# Altium schematic sheet [03] - SUMOBOT.SchDoc
size A4
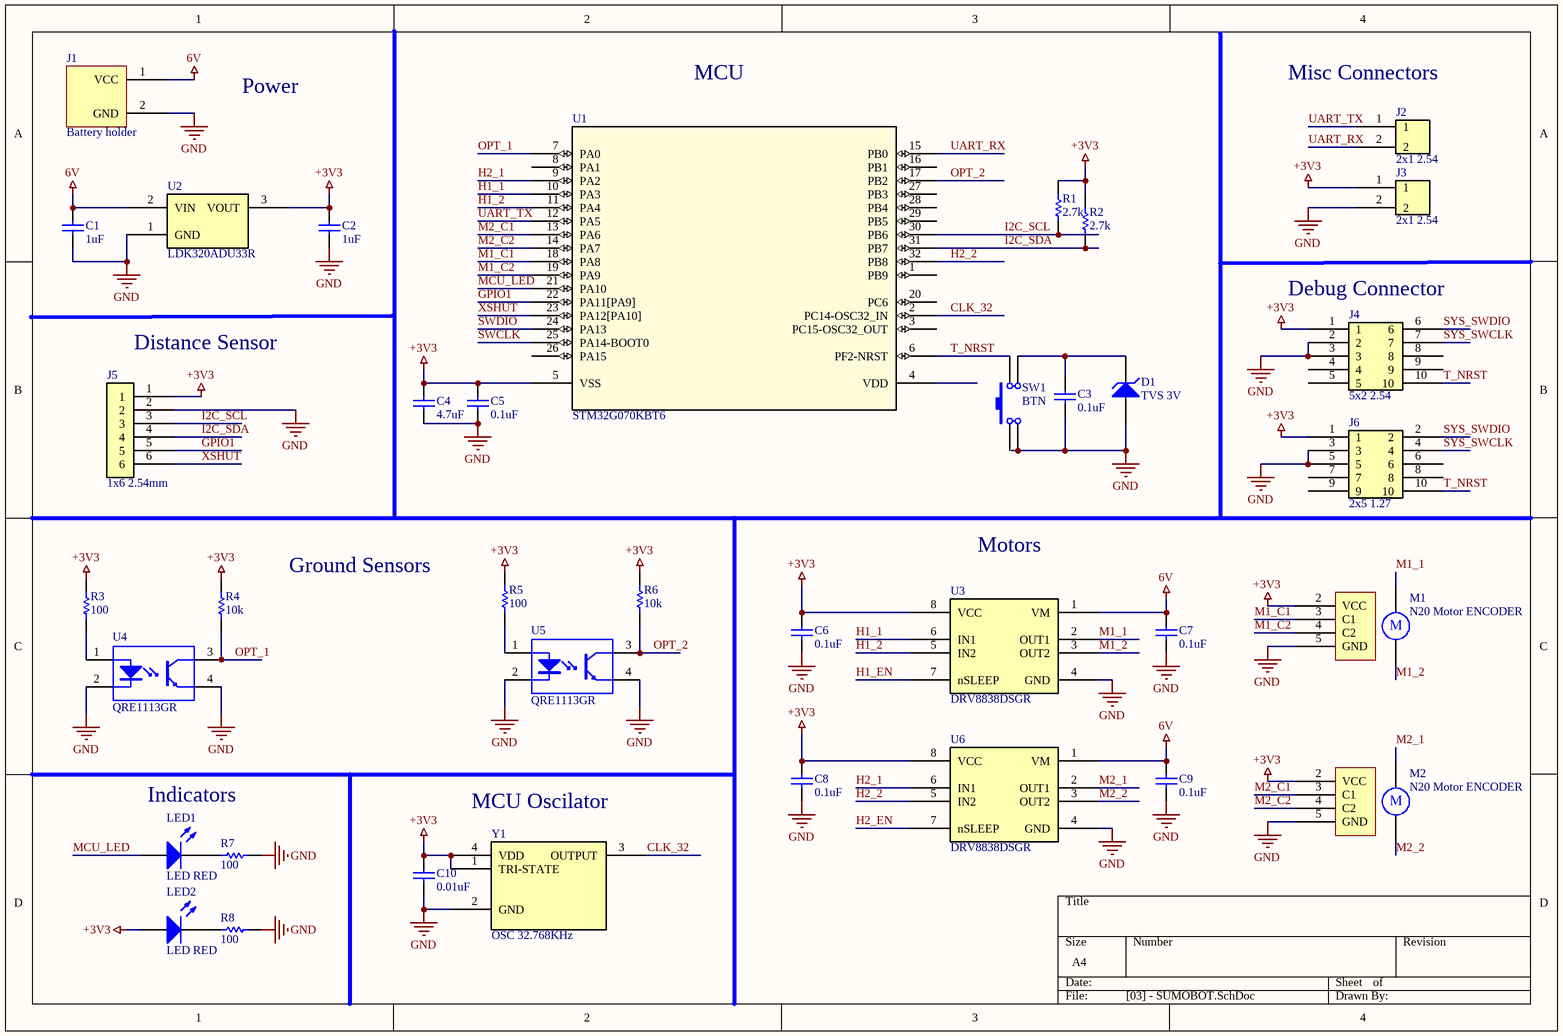
[diagram p0: [03] - SUMOBOT.SchDoc]

## Parts
C1  1uF  [CAPC2012X14N]
C2  1uF  [CAPC2012X14N]
C3  0.1uF  [CAPC2012X14N]
C4  4.7uF  [CAPC2012X14N]
C5  0.1uF  [CAPC2012X14N]
C6  0.1uF  [CAPC2012X14N]
C7  0.1uF  [CAPC2012X14N]
C8  0.1uF  [CAPC2012X14N]
C9  0.1uF  [CAPC2012X14N]
C10  0.01uF  [CAPC2012X14N]
D1  TVS 3V  [ST0201]
J1  Battery holder  [Battery Holder]
J2  2x1 2.54  [2 2.54]
J3  2x1 2.54  [2 2.54]
J4  5x2 2.54  [5x2 2.54]
J5  1x6 2.54mm  [PIN 6x1 2.54mm]
J6  2x5 1.27  [5x2 1.27]
LED1  LED RED  [LED 0805]
LED2  LED RED  [LED 0805]
M1  N20 Motor ENCODER  [N20 MOTOR - ENCODER]
M2  N20 Motor ENCODER  [N20 MOTOR - ENCODER]
R1  2.7k  [RESC2012X07N]
R2  2.7k  [RESC2012X07N]
R3  100  [RESC2012X07N]
R4  10k  [RESC2012X07N]
R5  100  [RESC2012X07N]
R6  10k  [RESC2012X07N]
R7  100  [RESC2012X07N]
R8  100  [RESC2012X07N]
SW1  BTN  [Button]
U1  STM32G070KBT6  [LQFP-32]
U2  LDK320ADU33R  [SOT89-150P349X160-3N]
U3  DRV8838DSGR  [SON50P200X80_HS-9N2]
U4  QRE1113GR  [FAIR-QRE1113GR_V]
U5  QRE1113GR  [FAIR-QRE1113GR_V]
U6  DRV8838DSGR  [SON50P200X80_HS-9N2]
Y1  OSC 32.768KHz  [ECS-327MVATX]

## Nets
6V: C1.2 C7.2 C9.2 J1.1(VCC) U2.2(VIN) U3.1(VM) U6.1(VM)
+3V3: C2.2 C4.2 C5.2 C6.2 C8.2 C10.2 J3.1 J4.1 J5.1 J6.1 LED2.1(A) M1.2(VCC) M2.2(VCC) R1.2 R2.2 R3.2 R4.2 R5.2 R6.2 U1.5(VSS) U2.3(VOUT) U3.8(VCC) U6.8(VCC) Y1.1(TRI-STATE) Y1.4(VDD)
GND: C1.1 C2.1 C3.1 C4.1 C5.1 C6.1 C7.1 C8.1 C9.1 C10.1 D1.2(A) J1.2(GND) J3.2 J4.2 J4.3 J5.2 J6.3 J6.5 M1.5(GND) M2.5(GND) R7.1 R8.1 SW1.2 U2.1(GND) U3.4(GND) U4.2(CATHODE) U4.4(EMITTER) U5.2(CATHODE) U5.4(EMITTER) U6.4(GND) Y1.2(GND)
CLK_32: U1.2(PC14-OSC32_IN) Y1.3(OUTPUT)
GPIO1: J5.5 U1.22(PA11[PA9])
H1_1: U1.10(PA3) U3.6(IN1)
H1_2: U1.11(PA4) U3.5(IN2)
H1_EN: U3.7(nSLEEP)
H2_1: U1.9(PA2) U6.6(IN1)
H2_2: U1.32(PB8) U6.5(IN2)
H2_EN: U6.7(nSLEEP)
I2C_SCL: J5.3 R1.1 U1.30(PB6)
I2C_SDA: J5.4 R2.1 U1.31(PB7)
M1_1: M1.1 U3.2(OUT1)
M1_2: M1.6 U3.3(OUT2)
M1_C1: M1.3(C1) U1.18(PA8)
M1_C2: M1.4(C2) U1.19(PA9)
M2_1: M2.1 U6.2(OUT1)
M2_2: M2.6 U6.3(OUT2)
M2_C1: M2.3(C1) U1.13(PA6)
M2_C2: M2.4(C2) U1.14(PA7)
MCU_LED: LED1.1(A) U1.21(PA10)
OPT_1: R4.1 U1.7(PA0) U4.3(COLLECTOR)
OPT_2: R6.1 U1.17(PB2) U5.3(COLLECTOR)
SWCLK: U1.25(PA14-BOOT0)
SWDIO: U1.24(PA13)
SYS_SWCLK: J4.7 J6.4
SYS_SWDIO: J4.6 J6.2
T_NRST: J4.10 J6.10 SW1.3 U1.6(PF2-NRST)
UART_RX: J2.2 U1.15(PB0)
UART_TX: J2.1 U1.12(PA5)
XSHUT: J5.6 U1.23(PA12[PA10])
NetC3_2: C3.2 D1.1(K) SW1.4
NetLED1_2: LED1.2(K) R7.2
NetLED2_2: LED2.2(K) R8.2
NetR3_1: R3.1 U4.1(ANODE)
NetR5_1: R5.1 U5.1(ANODE)

Not connected (* = marked no-connect by the designer): J4 4 5 8 9; J6 6 7 8 9; SW1 1; U1 1(PB9) 3(PC15-OSC32_OUT) 4(VDD) 8(PA1) 16(PB1) 20(PC6) 26(PA15) 27(PB3) 28(PB4) 29(PB5)

## Notes on the sheet
- Power
- MCU
- (near J2) Misc Connectors
- (near J4) Debug Connector
- (near J5) Distance Sensor
- Ground Sensors
- Motors
- Indicators
- (near Y1) MCU Oscilator
- (in symbol N20 Motor ENCODER) M

## Library data of the parts
C1 C2 = CL21B105KOFNNNG: Samsung Electro-Mechanics 1F Multilayer Ceramic Capacitor (MLCC) 16 V 10% X7R dielectric CL max op. temp. +125C; Voltage Rating: 16V; Supplier 1: Digi-Key; Manufacturer: Samsung; Manufacturer Part Number: CL21B105KOFNNNG; RoHS: Yes; Category: Ceramic Capacitors; Stock 1: 473549; Pricing 1: 1=0.10000, 10=0.06300, 100=0.02810, 500=0.02010, 1000=0.01579 (USD); Mount: Surface Mount; Case/Package: 0805; Case Code (Imperial): 0805; Material: Ceramic; Case Code (Metric): 2012; Min Operating Temperature: -55°C; Max Operating Temperature: 125°C; Dielectric: X7R; Package Quantity: 3000; Packaging: Tape and Reel; Capacitance: 1uF; Tolerance: 10%; Voltage: 16V; Length: 2mm; Height: 1.25mm; Width: 0.049inch; Thickness: 0.053inch; Depth: 1.25mm; Lead Free: Lead Free; ComponentLink1URL: https://datasheet.ciiva.com/25733/cl21b105kofnnng-25733281.pdf?src-supplier=Digi-Key; ComponentLink1Description: https://datasheet.ciiva.com/25733/cl21b105kofnnng-25733281.pdf?src-supplier=Digi-Key; ComponentLink2URL: https://datasheet.ciiva.com/29199/455935-da-01-en-vs-kondensator-0805-29199047.pdf?src-supplier=Conrad; ComponentLink2Description: https://datasheet.ciiva.com/29199/455935-da-01-en-vs-kondensator-0805-29199047.pdf?src-supplier=Conrad; ComponentLink3URL: https://datasheet.ciiva.com/16428/cl05b104kq5nnnc-16428885.pdf?src-supplier=Future+Electronics; ComponentLink3Description: https://datasheet.ciiva.com/16428/cl05b104kq5nnnc-16428885.pdf?src-supplier=Future+Electronics; ComponentLink4URL: https://datasheet.ciiva.com/26310/mlcc-catalogdownload2013-eng-26310156.pdf?src-supplier=Distrelec; ComponentLink4Description: https://datasheet.ciiva.com/26310/mlcc-catalogdownload2013-eng-26310156.pdf?src-supplier=Distrelec; Supplier Part Number 1: 1276-6471-1-ND
C3 C5-C9 = CL21F104ZBCNNNC: CAP CER 0.1UF 50V Y5V 0805; Manufacturer: Samsung; Material: Ceramic; Capacitance: 100nF; Tolerance: 80%; Supplier 1: Digi-Key; Manufacturer Part Number: CL21F104ZBCNNNC; RoHS: Yes; Category: Ceramic Capacitors; Stock 1: 1521483; Pricing 1: 1=0.10000, 10=0.04400, 100=0.01970, 500=0.01406, 1000=0.01104 (USD); Mount: Surface Mount; Case/Package: 0805; Case Code (Imperial): 0805; Case Code (Metric): 2012; Min Operating Temperature: -30°C; Max Operating Temperature: 85°C; Packaging: Cut Tape; Voltage Rating: 50V; Package Quantity: 1; Dielectric: Y5V; Length: 0.079inch; Height: 0.85mm; Thickness: 0.037inch; Depth: 1.25mm; Width: 0.049inch; Radiation Hardening: No; ComponentLink1URL: https://datasheet.ciiva.com/25802/cl21f104zbcnnnc-25802965.pdf?src-supplier=Digi-Key; ComponentLink1Description: https://datasheet.ciiva.com/25802/cl21f104zbcnnnc-25802965.pdf?src-supplier=Digi-Key; Supplier Part Number 1: 1276-1007-1-ND
C4 = CL21B475KOFNNNE: SAMSUNG ELECTRO-MECHANICS - CL21B475KOFNNNE - SMD Multilayer Ceramic Capacitor, 4.7 µF, 16 V, 0805 [2012 Metric], ± 10%, X7R, CL Series; Voltage Rating (DC): 16V; Supplier 1: Digi-Key; Manufacturer: Samsung; Manufacturer Part Number: CL21B475KOFNNNE; RoHS: Yes; Category: Ceramic Capacitors; Stock 1: 1327670; Pricing 1: 1=0.38000, 10=0.25800, 100=0.14600, 500=0.10304, 1000=0.09016 (USD); Mount: Surface Mount; Case/Package: 0805; Case Code (Imperial): 0805; Case Code (Metric): 2012; Min Operating Temperature: -55°C; Max Operating Temperature: 125°C; Dielectric: X7R; Package Quantity: 2000; Packaging: Tape and Reel; Capacitance: 4.7uF; Tolerance: 10%; Voltage Rating: 16V; Length: 2mm; Height: 1.25mm; Width: 0.049inch; Thickness: 0.053inch; Depth: 1.25mm; Radiation Hardening: No; Lead Free: Lead Free; ComponentLink1URL: https://datasheet.ciiva.com/15216/getdatasheetpartid-357405-15216237.pdf?src-supplier=Verical; ComponentLink1Description: https://datasheet.ciiva.com/15216/getdatasheetpartid-357405-15216237.pdf?src-supplier=Verical; Supplier Part Number 1: 1276-2873-1-ND
C10 = CL21B103KBANNNC: SAMSUNG ELECTRO-MECHANICS - CL21B103KBANNNC - SMD Vícevrstvý Keramický Kondenzátor, 10000 pF, 50 V, 0805 [2012 Metrické], ± 10%, X7R, CL Series; Material: Ceramic; Capacitance: 10nF; Voltage: 50V; Supplier 1: Digi-Key; Manufacturer: Samsung; Manufacturer Part Number: CL21B103KBANNNC; RoHS: Yes; Category: Ceramic Capacitors; Stock 1: 1821737; Pricing 1: 1=0.10000, 10=0.05200, 100=0.02310, 500=0.01652, 1000=0.01298 (USD); Mount: Surface Mount; Case/Package: 0805; Case Code (Metric): 2012; Case Code (Imperial): 0805; Contact Plating: Tin; Min Operating Temperature: -55°C; Max Operating Temperature: 125°C; Tolerance: 10%; Dielectric: X7R; Voltage Rating (DC): 50V; Packaging: Tape and Reel; Voltage Rating: 50V; Length: 2mm; Height: 0.65mm; Depth: 1.25mm; Width: 0.049inch; Thickness: 0.03inch; Radiation Hardening: No; Lead Free: Lead Free; ComponentLink1URL: https://datasheet.ciiva.com/25709/cl21b103kbannnc-25709781.pdf?src-supplier=Digi-Key; ComponentLink1Description: https://datasheet.ciiva.com/25709/cl21b103kbannnc-25709781.pdf?src-supplier=Digi-Key; ComponentLink2URL: https://datasheet.ciiva.com/29199/455082-da-01-en-vs-kondensator-0805-29199459.pdf?src-supplier=Conrad; ComponentLink2Description: https://datasheet.ciiva.com/29199/455082-da-01-en-vs-kondensator-0805-29199459.pdf?src-supplier=Conrad; Supplier Part Number 1: 1276-1015-1-ND
D1 = ESDALC6V1-1U2: ESD Suppressor TVS 8KV 2-Pin SMD T/R; Manufacturer: STMicroelectronics; Direction: Unidirectional; Element Configuration: Single; Number of Unidirectional Channels: 1; Min Breakdown Voltage: 6.1V; Peak Pulse Power: 20W; Power Line Protection: No; Max Reverse Leakage Current: 100nA; Max Breakdown Voltage: 8V; Capacitance: 12pF; Clamping Voltage: 12.2V; ESD Protection: Yes; Test Current: 1mA; Peak Pulse Current: 2A; Supplier 1: Digi-Key; Manufacturer Part Number: ESDALC6V1-1U2; Stock 1: 10389; Pricing 1: 1=0.37000, 10=0.27500, 25=0.24800, 100=0.13080, 250=0.12944, 500=0.11590, 1000=0.09020, 2500=0.08253, 5000=0.07893 (USD); RoHS: Yes; Mount: Surface Mount; Case/Package: SMD/SMT; Number of Pins: 2; Case Code (Imperial): 0201; Case Code (Metric): 0603; Min Operating Temperature: -40°C; Max Operating Temperature: 125°C; Reverse Standoff Voltage: 3V; Package Quantity: 1; Packaging: Tape and Reel; Breakdown Voltage: 6.1V; Polarity: Unidirectional; Leakage Current: 100nA; Max Power Dissipation: 20W; Composition: Zener; Number of Channels: 1; Power Dissipation: 20W; Termination: SMD/SMT; Reverse Breakdown Voltage: 6.1V; Number of Elements: 1; Length: 0.6mm; Height: 0.33mm; Depth: 0.3mm; Width: 0.35mm; Radiation Hardening: No; Lead Free: Lead Free; REACH SVHC: No SVHC; ComponentLink1URL: https://datasheet.ciiva.com/1276/1684876-1276912.pdf?src-supplier=Element14; ComponentLink1Description: https://datasheet.ciiva.com/1276/1684876-1276912.pdf?src-supplier=Element14; ComponentLink2URL: https://datasheet.ciiva.com/16205/cd00212838-16205762.pdf?src-supplier=Future+Electronics; ComponentLink2Description: https://datasheet.ciiva.com/16205/cd00212838-16205762.pdf?src-supplier=Future+Electronics; ComponentLink3URL: https://datasheet.ciiva.com/4507/cd00212838-88488-4507763.pdf?src-supplier=Mouser; ComponentLink3Description: https://datasheet.ciiva.com/4507/cd00212838-88488-4507763.pdf?src-supplier=Mouser; ComponentLink4URL: https://datasheet.ciiva.com/15143/getdatasheetpartid-185245-15143908.pdf?src-supplier=Verical; ComponentLink4Description: https://datasheet.ciiva.com/15143/getdatasheetpartid-185245-15143908.pdf?src-supplier=Verical; ComponentLink5URL: https://datasheet.ciiva.com/337/cd00212838-337651.pdf?src-supplier=Digi-Key; ComponentLink5Description: https://datasheet.ciiva.com/337/cd00212838-337651.pdf?src-supplier=Digi-Key; ComponentLink6URL: https://datasheet.ciiva.com/337/cd00212838-337652.pdf?src-supplier=Digi-Key; ComponentLink6Description: https://datasheet.ciiva.com/337/cd00212838-337652.pdf?src-supplier=Digi-Key; ComponentLink7URL: https://datasheet.ciiva.com/337/cd00212838-337653.pdf?src-supplier=Digi-Key; ComponentLink7Description: https://datasheet.ciiva.com/337/cd00212838-337653.pdf?src-supplier=Digi-Key; ComponentLink8URL: https://datasheet.ciiva.com/11193/cd00212838-11193350.pdf?src-supplier=Avnet; ComponentLink8Description: https://datasheet.ciiva.com/11193/cd00212838-11193350.pdf?src-supplier=Avnet; ComponentLink9URL: https://datasheet.ciiva.com/22695/1684876-22695674.pdf?src-supplier=Element14; ComponentLink9Description: https://datasheet.ciiva.com/22695/1684876-22695674.pdf?src-supplier=Element14; ComponentLink10URL: https://datasheet.ciiva.com/41443/001184301-da-01-en-transil-sgl-un-esdalc6v1-1u2-st-0201-stm-41443159.pdf?src-supplier=Conrad; ComponentLink10Description: https://datasheet.ciiva.com/41443/001184301-da-01-en-transil-sgl-un-esdalc6v1-1u2-st-0201-stm-41443159.pdf?src-supplier=Conrad; Supplier Part Number 1: 497-8752-1-ND
J2 J3 = PREC002SAAN-RC: CONN HEADER VERT 2POS 2.54MM; Manufacturer: Sullins; Number of Positions: 2; Connector Type: Male Pin; Pitch: 0.1inch; Supplier 1: Digi-Key; Manufacturer Part Number: PREC002SAAN-RC; Stock 1: 67037; Pricing 1: 1=0.06000, 10=0.05600, 25=0.04160, 50=0.03560, 100=0.03450, 250=0.02972, 500=0.02852 (USD); RoHS: Yes; Mount: Through Hole; Color: Black; Contact Plating: Tin; Termination: Solder; Package Quantity: 1; Number of Rows: 1; Packaging: Bulk; Contact Mating Length: 0.23inch; ComponentLink1URL: https://datasheet.ciiva.com/740/zrzczzzszzn-rc-st-11635-b-740843.pdf?src-supplier=Digi-Key; ComponentLink1Description: https://datasheet.ciiva.com/740/zrzczzzszzn-rc-st-11635-b-740843.pdf?src-supplier=Digi-Key; Supplier Part Number 1: S1012EC-02-ND
J4 = PH2-10-UA: Conn Unshrouded Header HDR 80 POS 2.54mm Solder RA Thru-Hole Bag; Manufacturer: Adam Equipment; Number of Positions: 10; Voltage Rating: 250V; Current Rating: 3A; Insulation Resistance: 5GR; Supplier 1: Digi-Key; Manufacturer Part Number: PH2-10-UA; Stock 1: 345; Pricing 1: 1=0.19000, 10=0.18100, 100=0.11160, 500=0.09236, 1000=0.08081, 5000=0.06926, 10000=0.06734 (USD); RoHS: Yes; Contact Material: Brass; Material: Polybutylene; Color: Black; Contact Plating: Gold; Min Operating Temperature: -40°C; Max Operating Temperature: 105°C; Number of Rows: 2; Termination: PCB; Number of Contacts: 10; Packaging: Tray; Pitch: 2.54mm; Lead Free: Lead Free; ComponentLink1URL: https://datasheet.ciiva.com/16207/page-312-315-16207029.pdf?src-supplier=Future+Electronics; ComponentLink1Description: https://datasheet.ciiva.com/16207/page-312-315-16207029.pdf?src-supplier=Future+Electronics; ComponentLink2URL: https://datasheet.ciiva.com/13676/page-292-295-13676648.pdf?src-supplier=Mouser; ComponentLink2Description: https://datasheet.ciiva.com/13676/page-292-295-13676648.pdf?src-supplier=Mouser; Supplier Part Number 1: 2057-PH2-10-UA-ND
J5 = PH1RA-06-UA: Conn Unshrouded Header HDR 6 POS 2.54mm Solder RA Thru-Hole; Manufacturer: Adam Equipment; Supplier 1: Digi-Key; Manufacturer Part Number: PH1RA-06-UA; RoHS: No; Category: Connectors; Stock 1: 169; Pricing 1: 1=0.19000, 10=0.18200, 100=0.12600, 500=0.10666, 1000=0.08726, 5000=0.07757, 10000=0.07030 (USD); Supplier Part Number 1: 2057-PH1RA-06-UA-ND
J6 = 3220-10-0100-00: CONN HEADER VERT 10POS 1.27MM; Manufacturer: CNC Tech; Connector Type: Male Pin; Number of Positions: 10; Pitch: 0.05inch; Supplier 1: Digi-Key; Manufacturer Part Number: 3220-10-0100-00; Stock 1: 50248; Pricing 1: 1=0.58000, 10=0.54000, 100=0.41400, 500=0.36000, 1000=0.29700, 5000=0.26100, 10000=0.24300 (USD); RoHS: Yes; Mount: Through Hole; Contact Plating: Gold; Package Quantity: 3200; Packaging: Tray; Number of Rows: 2; Termination: Solder; Row Spacing: 0.05inch; ComponentLink1URL: https://datasheet.ciiva.com/18655/3220-xx-0100-00-18655342.pdf?src-supplier=Digi-Key; ComponentLink1Description: https://datasheet.ciiva.com/18655/3220-xx-0100-00-18655342.pdf?src-supplier=Digi-Key; Supplier Part Number 1: 1175-1627-ND
LED1 LED2 = 150080RS75000: SMD LED red 2.4 V 0805, 150080RS75000, Würth Elektronik; Manufacturer: Wurth Electronics; Luminous Intensity: 150mcd; Viewing Angle: 140°; Forward Voltage: 2V; Wavelength: 625nm; Lens Style: Clear,Rectangular; Forward Current: 30mA; Test Current: 20mA; Supplier 1: Digi-Key; Manufacturer Part Number: 150080RS75000; RoHS: Yes; Category: LEDs; Stock 1: 82254; Pricing 1: 1=0.18000, 50=0.16500, 100=0.14200, 500=0.12300 (USD); Mount: Surface Mount; Case/Package: 0805; Color: Red; Case Code (Metric): 2012; Case Code (Imperial): 0805; Min Operating Temperature: -40°C; Max Operating Temperature: 85°C; Package Quantity: 4000; Packaging: Tape and Reel; Dominant Wavelength: 625nm; Length: 2mm; Height: 0.7mm; Width: 1.25mm; REACH SVHC: Unknown; ComponentLink1URL: https://datasheet.ciiva.com/22656/150080rs75000-22656961.pdf?src-supplier=Element14; ComponentLink1Description: https://datasheet.ciiva.com/22656/150080rs75000-22656961.pdf?src-supplier=Element14; ComponentLink2URL: https://datasheet.ciiva.com/29279/759435-da-01-en-chipled-0805-w-kl-rot-150080rs75000-29279032.pdf?src-supplier=Conrad; ComponentLink2Description: https://datasheet.ciiva.com/29279/759435-da-01-en-chipled-0805-w-kl-rot-150080rs75000-29279032.pdf?src-supplier=Conrad; Supplier Part Number 1: 732-4984-1-ND
R1 R2 = ERJ-6ENF2701V: Res Thick Film 0805 2.7K Ohm 1% 0.125W(1/8W) ±100ppm/C Pad SMD Automotive T/R; Manufacturer: Panasonic; Resistance: 2.7kR; Temperature Coefficient: 100ppm/°C; Power Rating: 125mW; Voltage Rating: 150V; Supplier 1: Digi-Key; Manufacturer Part Number: ERJ-6ENF2701V; RoHS: Yes; Category: Chip SMD Resistors; Stock 1: 161555; Pricing 1: 1=0.10000, 10=0.07700, 100=0.02960, 1000=0.01302, 2500=0.01125 (USD); Mount: Surface Mount; Case/Package: 0805; Number of Pins: 2; Weight: 0.01lb; Contact Plating: Tin; Case Code (Metric): 2012; Case Code (Imperial): 0805; Min Operating Temperature: -55°C; Max Operating Temperature: 155°C; Tolerance: 1%; Composition: Thick Film; Packaging: Tape and Reel; Package Quantity: 1; Number of Terminations: 2; Termination: SMD/SMT; Military Standard: Not; Max Power Dissipation: 125mW; Voltage Rating (DC): 150V; Features: Automotive AEC-Q200; Length: 2mm; Height: 0.6mm; Width: 0.049inch; Depth: 1.25mm; Radiation Hardening: No; REACH SVHC: No SVHC; Lead Free: Lead Free; ComponentLink1URL: https://datasheet.ciiva.com/11821/0900766b80f80784-11821609.pdf?src-supplier=RSComponents; ComponentLink1Description: https://datasheet.ciiva.com/11821/0900766b80f80784-11821609.pdf?src-supplier=RSComponents; ComponentLink2URL: https://datasheet.ciiva.com/24026/aoa0000ce2-24026470.pdf?src-supplier=Mouser; ComponentLink2Description: https://datasheet.ciiva.com/24026/aoa0000ce2-24026470.pdf?src-supplier=Mouser; ComponentLink3URL: https://datasheet.ciiva.com/7802/426256-7802440.pdf?src-supplier=Element14; ComponentLink3Description: https://datasheet.ciiva.com/7802/426256-7802440.pdf?src-supplier=Element14; ComponentLink4URL: https://datasheet.ciiva.com/22687/1678782-22687080.pdf?src-supplier=Element14; ComponentLink4Description: https://datasheet.ciiva.com/22687/1678782-22687080.pdf?src-supplier=Element14; ComponentLink5URL: https://datasheet.ciiva.com/6138/426256-6138186.pdf?src-supplier=Farnell; ComponentLink5Description: https://datasheet.ciiva.com/6138/426256-6138186.pdf?src-supplier=Farnell; ComponentLink6URL: https://datasheet.ciiva.com/22668/1678782-22668333.pdf?src-supplier=Element14; ComponentLink6Description: https://datasheet.ciiva.com/22668/1678782-22668333.pdf?src-supplier=Element14; ComponentLink7URL: https://datasheet.ciiva.com/30131/aoa0000ce2-30131518.pdf?src-supplier=Onlinecomponents.com; ComponentLink7Description: https://datasheet.ciiva.com/30131/aoa0000ce2-30131518.pdf?src-supplier=Onlinecomponents.com; Supplier Part Number 1: P2.70KCCT-ND
R3 R5 R7 R8 = ERJ-6ENF1000V: PANASONIC - ERJ6ENF1000V - DICKSCH.WIDERSTAND 100R 1% 0.125W 0805; Temperature Coefficient: 100ppm/°C; Voltage Rating: 150V; Power Rating: 125mW; Supplier 1: Digi-Key; Manufacturer: Panasonic; Manufacturer Part Number: ERJ-6ENF1000V; RoHS: Yes; Category: Chip SMD Resistors; Stock 1: 222933; Pricing 1: 1=0.10000, 10=0.07200, 100=0.02750, 1000=0.01210, 2500=0.01045 (USD); Mount: Surface Mount; Case/Package: 0805; Number of Pins: 2; Contact Plating: Tin; Case Code (Imperial): 0805; Case Code (Metric): 2012; Min Operating Temperature: -55°C; Max Operating Temperature: 155°C; Resistance: 100R; Tolerance: 1%; Composition: Thick Film; Packaging: Tape and Reel; Package Quantity: 1; Number of Terminations: 2; Termination: SMD/SMT; Military Standard: Not; Max Power Dissipation: 125mW; Voltage Rating (DC): 150V; Features: Automotive AEC-Q200; Length: 2mm; Height: 0.6mm; Width: 1.2mm; Depth: 1.25mm; Radiation Hardening: No; REACH SVHC: No SVHC; Lead Free: Lead Free; ComponentLink1URL: https://datasheet.ciiva.com/11808/0900766b80f80784-11808206.pdf?src-supplier=RSComponents; ComponentLink1Description: https://datasheet.ciiva.com/11808/0900766b80f80784-11808206.pdf?src-supplier=RSComponents; ComponentLink2URL: https://datasheet.ciiva.com/46419/1678782-46419878.pdf?src-supplier=Element14; ComponentLink2Description: https://datasheet.ciiva.com/46419/1678782-46419878.pdf?src-supplier=Element14; ComponentLink3URL: https://datasheet.ciiva.com/7830/426256-7830744.pdf?src-supplier=Element14; ComponentLink3Description: https://datasheet.ciiva.com/7830/426256-7830744.pdf?src-supplier=Element14; ComponentLink4URL: https://datasheet.ciiva.com/7830/1678782-7830986.pdf?src-supplier=Element14; ComponentLink4Description: https://datasheet.ciiva.com/7830/1678782-7830986.pdf?src-supplier=Element14; ComponentLink5URL: https://datasheet.ciiva.com/16765/70260748-16765594.pdf?src-supplier=Allied+Electronics; ComponentLink5Description: https://datasheet.ciiva.com/16765/70260748-16765594.pdf?src-supplier=Allied+Electronics; ComponentLink6URL: https://datasheet.ciiva.com/30154/aoa0000ce2-30154938.pdf?src-supplier=Onlinecomponents.com; ComponentLink6Description: https://datasheet.ciiva.com/30154/aoa0000ce2-30154938.pdf?src-supplier=Onlinecomponents.com; ComponentLink7URL: https://datasheet.ciiva.com/9186/aoa0000ce2-9186686.pdf?src-supplier=Avnet; ComponentLink7Description: https://datasheet.ciiva.com/9186/aoa0000ce2-9186686.pdf?src-supplier=Avnet; Supplier Part Number 1: P100CCT-ND
R4 R6 = ERJ-6ENF1002V: PANASONIC - ERJ6ENF1002V - Ytmonterat chipmotstånd, Tjockfilm, 0805 [2012 Metrisk], 10 kohm, ERJ6E Serien, 150 V, Tjockfilm; Resistance: 10kR; Tolerance: 1%; Temperature Coefficient: 100ppm/°C; Power Rating: 125mW; Voltage Rating: 150V; Supplier 1: Digi-Key; Manufacturer: Panasonic; Manufacturer Part Number: ERJ-6ENF1002V; RoHS: Yes; Category: Chip SMD Resistors; Stock 1: 438806; Pricing 1: 1=0.10000, 10=0.07200, 100=0.02750, 1000=0.01210, 2500=0.01045 (USD); Mount: Surface Mount; Case/Package: 0805; Number of Pins: 2; Case Code (Metric): 2012; Case Code (Imperial): 0805; Contact Plating: Tin; Min Operating Temperature: -55°C; Max Operating Temperature: 155°C; Packaging: Tape and Reel; Composition: Thick Film; Package Quantity: 5000; Number of Terminations: 2; Termination: SMD/SMT; Max Power Dissipation: 125mW; Voltage Rating (DC): 150V; Military Standard: Not; Working Voltage: 150V; Features: Automotive AEC-Q200; Length: 2mm; Height: 0.6mm; Width: 0.049inch; Depth: 1.25mm; Radiation Hardening: No; Lead Free: Lead Free; REACH SVHC: No SVHC; ComponentLink1URL: https://datasheet.ciiva.com/11808/0900766b80f80784-11808080.pdf?src-supplier=RSComponents; ComponentLink1Description: https://datasheet.ciiva.com/11808/0900766b80f80784-11808080.pdf?src-supplier=RSComponents; ComponentLink2URL: https://datasheet.ciiva.com/16514/aoa0000ce2-16514021.pdf?src-supplier=Avnet+Asia; ComponentLink2Description: https://datasheet.ciiva.com/16514/aoa0000ce2-16514021.pdf?src-supplier=Avnet+Asia; ComponentLink3URL: https://datasheet.ciiva.com/27055/1988971-27055733.pdf?src-supplier=Jameco; ComponentLink3Description: https://datasheet.ciiva.com/27055/1988971-27055733.pdf?src-supplier=Jameco; ComponentLink4URL: https://datasheet.ciiva.com/16759/70260748-16759350.pdf?src-supplier=Allied+Electronics; ComponentLink4Description: https://datasheet.ciiva.com/16759/70260748-16759350.pdf?src-supplier=Allied+Electronics; ComponentLink5URL: https://datasheet.ciiva.com/16725/70260748-16725031.pdf?src-supplier=Allied+Electronics; ComponentLink5Description: https://datasheet.ciiva.com/16725/70260748-16725031.pdf?src-supplier=Allied+Electronics; ComponentLink6URL: https://datasheet.ciiva.com/7830/426256-7830745.pdf?src-supplier=Element14; ComponentLink6Description: https://datasheet.ciiva.com/7830/426256-7830745.pdf?src-supplier=Element14; ComponentLink7URL: https://datasheet.ciiva.com/46372/1678782-46372714.pdf?src-supplier=Element14; ComponentLink7Description: https://datasheet.ciiva.com/46372/1678782-46372714.pdf?src-supplier=Element14; ComponentLink8URL: https://datasheet.ciiva.com/46372/1678782-46372715.pdf?src-supplier=Element14; ComponentLink8Description: https://datasheet.ciiva.com/46372/1678782-46372715.pdf?src-supplier=Element14; ComponentLink9URL: https://datasheet.ciiva.com/17212/aoa0000ce2-17212108.pdf?src-supplier=Avnet+Europe; ComponentLink9Description: https://datasheet.ciiva.com/17212/aoa0000ce2-17212108.pdf?src-supplier=Avnet+Europe; ComponentLink10URL: https://datasheet.ciiva.com/30140/aoa0000ce2-30140236.pdf?src-supplier=Onlinecomponents.com; ComponentLink10Description: https://datasheet.ciiva.com/30140/aoa0000ce2-30140236.pdf?src-supplier=Onlinecomponents.com; ComponentLink11URL: https://datasheet.ciiva.com/24070/aoa0000ce2-24070702.pdf?src-supplier=Mouser; ComponentLink11Description: https://datasheet.ciiva.com/24070/aoa0000ce2-24070702.pdf?src-supplier=Mouser; Supplier Part Number 1: P10.0KCCT-ND
SW1 = PTS647SK70SMTR2LFS: INWALL LENS COVER , WHITE , 6 (; Manufacturer: ITT C&K; Supplier 1: Digi-Key; Manufacturer Part Number: PTS647SK70SMTR2LFS; Stock 1: 97905; Pricing 1: 1 = 0,14000, 10 = 0,14000, 25 = 0,13520, 50 = 0,13020, 100 = 0,12310, 250 = 0,11580, 500 = 0,11100 (USD); RoHS: No; Supplier Part Number 1: PTS647SK70SMTR2LFSCT-ND
U1 = STM32G070KBT6: Cortex M0+ 128K LQFP32 85°C; Manufacturer: STMicroelectronics; Interface: I2C,SPI,I2S,USART,LIN; Memory Type: FLASH; Core Architecture: ARM; Data Bus Width: 32b; Max Frequency: 64MHz; Memory Size: 128KB; RAM Size: 36KB; Number of I/Os: 29; Number of ADC Channels: 13; Max Supply Voltage: 3.6V; Min Supply Voltage: 2V; Supplier 1: Digi-Key; Manufacturer Part Number: STM32G070KBT6; RoHS: No; Category: Microcontrollers; Stock 1: 977; Pricing 1: 1=1.75000, 10=1.57400, 25=1.48520, 100=1.26520, 250=1.18800, 500=1.03950, 1000=0.86130, 2500=0.80190, 5000=0.77220 (USD); Case/Package: LQFP; Min Operating Temperature: -40°C; Max Operating Temperature: 85°C; Package Quantity: 250; ComponentLink1URL: https://datasheet.ciiva.com/71223/stm32g070cb-1517433-71223599.pdf?src-supplier=Mouser; ComponentLink1Description: https://datasheet.ciiva.com/71223/stm32g070cb-1517433-71223599.pdf?src-supplier=Mouser; Supplier Part Number 1: 497-STM32G070KBT6-ND
U2 = LDK320ADU33R: LDO Regulator Pos 3.3V 0.2A 4-Pin(3+Tab) SOT-89 T/R; Manufacturer: STMicroelectronics; Output Type: Fixed; Output Configuration: Positive; Number of Regulators: 1; Max Input Voltage: 18V; Dropout Voltage: 350mV; Output Current: 200mA; Quiescent Current: 90uA; Max Supply Current: 100uA; Power Supply Rejection Ratio (PSRR): 88dB; Supplier 1: Digi-Key; Manufacturer Part Number: LDK320ADU33R; RoHS: No; Category: Voltage Regulators - Linear; Stock 1: 6948; Pricing 1: 1=0.62000, 10=0.54100, 25=0.50840, 100=0.38540, 250=0.32800, 500=0.31160, 1000=0.23780 (USD); Mount: Surface Mount; Case/Package: SOT-89; Min Operating Temperature: -40°C; Max Operating Temperature: 125°C; Packaging: Tape and Reel; Min Output Voltage: 3.3V; ComponentLink1URL: http://farnell.com//datasheets/2342740.pdf?src-supplier=Farnell; ComponentLink1Description: http://farnell.com//datasheets/2342740.pdf?src-supplier=Farnell; ComponentLink2URL: https://www.st.com/resource/en/datasheet/ldk320.pdf?src-supplier=Digi-Key; ComponentLink2Description: https://www.st.com/resource/en/datasheet/ldk320.pdf?src-supplier=Digi-Key; Supplier Part Number 1: 497-17585-1-ND; Revised: *
U3 U6 = DRV8838DSGR: TEXAS INSTRUMENTS - DRV8838DSGR - Motor Driver, Low Voltage H Bridge, 2 Outputs, 1.8 V to 7 V Supply, 0 V to 11 V/1.8 A Out, WSON-8; Output Current: 1.8A; Number of Outputs: 1; Min Supply Voltage: 1.8V; Max Supply Voltage: 7V; Interface: On/Off,Parallel; Fault Protection: Over Temperature,Short Circuit; Drain to Source Resistance: 280mR; Supplier 1: Digi-Key; Manufacturer: Texas Instruments; Manufacturer Part Number: DRV8838DSGR; RoHS: Yes; Category: Integrated Circuits (ICs); Stock 1: 9352; Pricing 1: 1=1.06000, 10=0.94400, 25=0.89600, 100=0.68800, 250=0.60800, 500=0.57600, 1000=0.44800 (USD); Mount: Surface Mount; Number of Pins: 8; Weight: 0.000384oz; Min Operating Temperature: -40°C; Max Operating Temperature: 85°C; Package Quantity: 3000; Packaging: Tape and Reel; Max Output Current: 1.8A; Radiation Hardening: No; REACH SVHC: No SVHC; Lead Free: Lead Free; ComponentLink1URL: https://datasheet.ciiva.com/48511/drv8838-48511301.pdf?src-supplier=Avnet; ComponentLink1Description: https://datasheet.ciiva.com/48511/drv8838-48511301.pdf?src-supplier=Avnet; Supplier Part Number 1: 296-40081-1-ND
U4 U5 = QRE1113GR: Photointerrupter Reflective Phototransistor 4-Pin Miniature SMT T/R; Manufacturer: ON Semiconductor / Fairchild; Wavelength: 940nm; Forward Current: 50mA; Rise Time: 20us; Forward Voltage: 1.2V; Sensing Distance: 0.197inch; Collector Emitter Voltage (VCEO): 30V; Max Collector Current: 20mA; Number of Channels: 1; Reverse Breakdown Voltage: 5V; Power Dissipation: 75mW; Operating Supply Voltage: 1.7V; Supplier 1: Digi-Key; Manufacturer Part Number: QRE1113GR; RoHS: Yes; Category: Phototransistor; Stock 1: 33876; Pricing 1: 1=1.04000, 10=0.80500, 100=0.51750, 500=0.43700 (USD); Mount: Surface Mount; Case/Package: SMD/SMT; Number of Pins: 4; Weight: 0.078g; Contact Plating: Tin,Matte; Min Operating Temperature: -40°C; Max Operating Temperature: 85°C; Packaging: Tape and Reel; Fall Time: 20us; Package Quantity: 1000; Reverse Voltage (DC): 5V; Collector Emitter Breakdown Voltage: 30V; Response Time: 20us; Max Breakdown Voltage: 30V; Number of Elements: 1; Input Current: 50mA; Max Power Dissipation: 75mW; Output Type: Phototransistor; Length: 3.6mm; Height: 1.7mm; Width: 2.9mm; Radiation Hardening: No; REACH SVHC: No SVHC; Lead Free: Lead Free; ComponentLink1URL: https://datasheet.ciiva.com/15116/getdatasheetpartid-146181-15116981.pdf?src-supplier=Verical; ComponentLink1Description: https://datasheet.ciiva.com/15116/getdatasheetpartid-146181-15116981.pdf?src-supplier=Verical; ComponentLink2URL: https://datasheet.ciiva.com/8074/1725706-8074165.pdf?src-supplier=Element14; ComponentLink2Description: https://datasheet.ciiva.com/8074/1725706-8074165.pdf?src-supplier=Element14; ComponentLink3URL: https://datasheet.ciiva.com/8273/qre1113-8273303.pdf?src-supplier=Avnet; ComponentLink3Description: https://datasheet.ciiva.com/8273/qre1113-8273303.pdf?src-supplier=Avnet; ComponentLink4URL: https://datasheet.ciiva.com/26228/qre1113-26228935.pdf?src-supplier=Avnet+Europe; ComponentLink4Description: https://datasheet.ciiva.com/26228/qre1113-26228935.pdf?src-supplier=Avnet+Europe; ComponentLink5URL: https://datasheet.ciiva.com/2823/qre1113-2823864.pdf?src-supplier=Digi-Key; ComponentLink5Description: https://datasheet.ciiva.com/2823/qre1113-2823864.pdf?src-supplier=Digi-Key; ComponentLink6URL: https://datasheet.ciiva.com/2823/qre1113-2823865.pdf?src-supplier=Digi-Key; ComponentLink6Description: https://datasheet.ciiva.com/2823/qre1113-2823865.pdf?src-supplier=Digi-Key; ComponentLink7URL: https://datasheet.ciiva.com/2823/qre1113-2823866.pdf?src-supplier=Digi-Key; ComponentLink7Description: https://datasheet.ciiva.com/2823/qre1113-2823866.pdf?src-supplier=Digi-Key; ComponentLink8URL: https://datasheet.ciiva.com/3305/qre1113-3305755.pdf?src-supplier=Avnet; ComponentLink8Description: https://datasheet.ciiva.com/3305/qre1113-3305755.pdf?src-supplier=Avnet; Supplier Part Number 1: QRE1113GRCT-ND
Y1 = ECS-327MVATX-3-CN-TR: Oscillator XO 0.032768MHz ±25ppm 15pF CMOS 55% 1.8V/2.5V/3.3V 4-Pin Mini-SMD T/R; Manufacturer: ECS International; Revised: JCM; Supplier 1: Digi-Key; Manufacturer Part Number: ECS-327MVATX-3-CN-TR; Stock 1: 696; Pricing 1: 1=1.03000, 10=0.91100, 50=0.85140, 100=0.75240, 500=0.71280 (USD); RoHS: No; Supplier Part Number 1: XC3155CT-ND